# EAGLE design twip-mb2 (EAGLE 9.3.0)
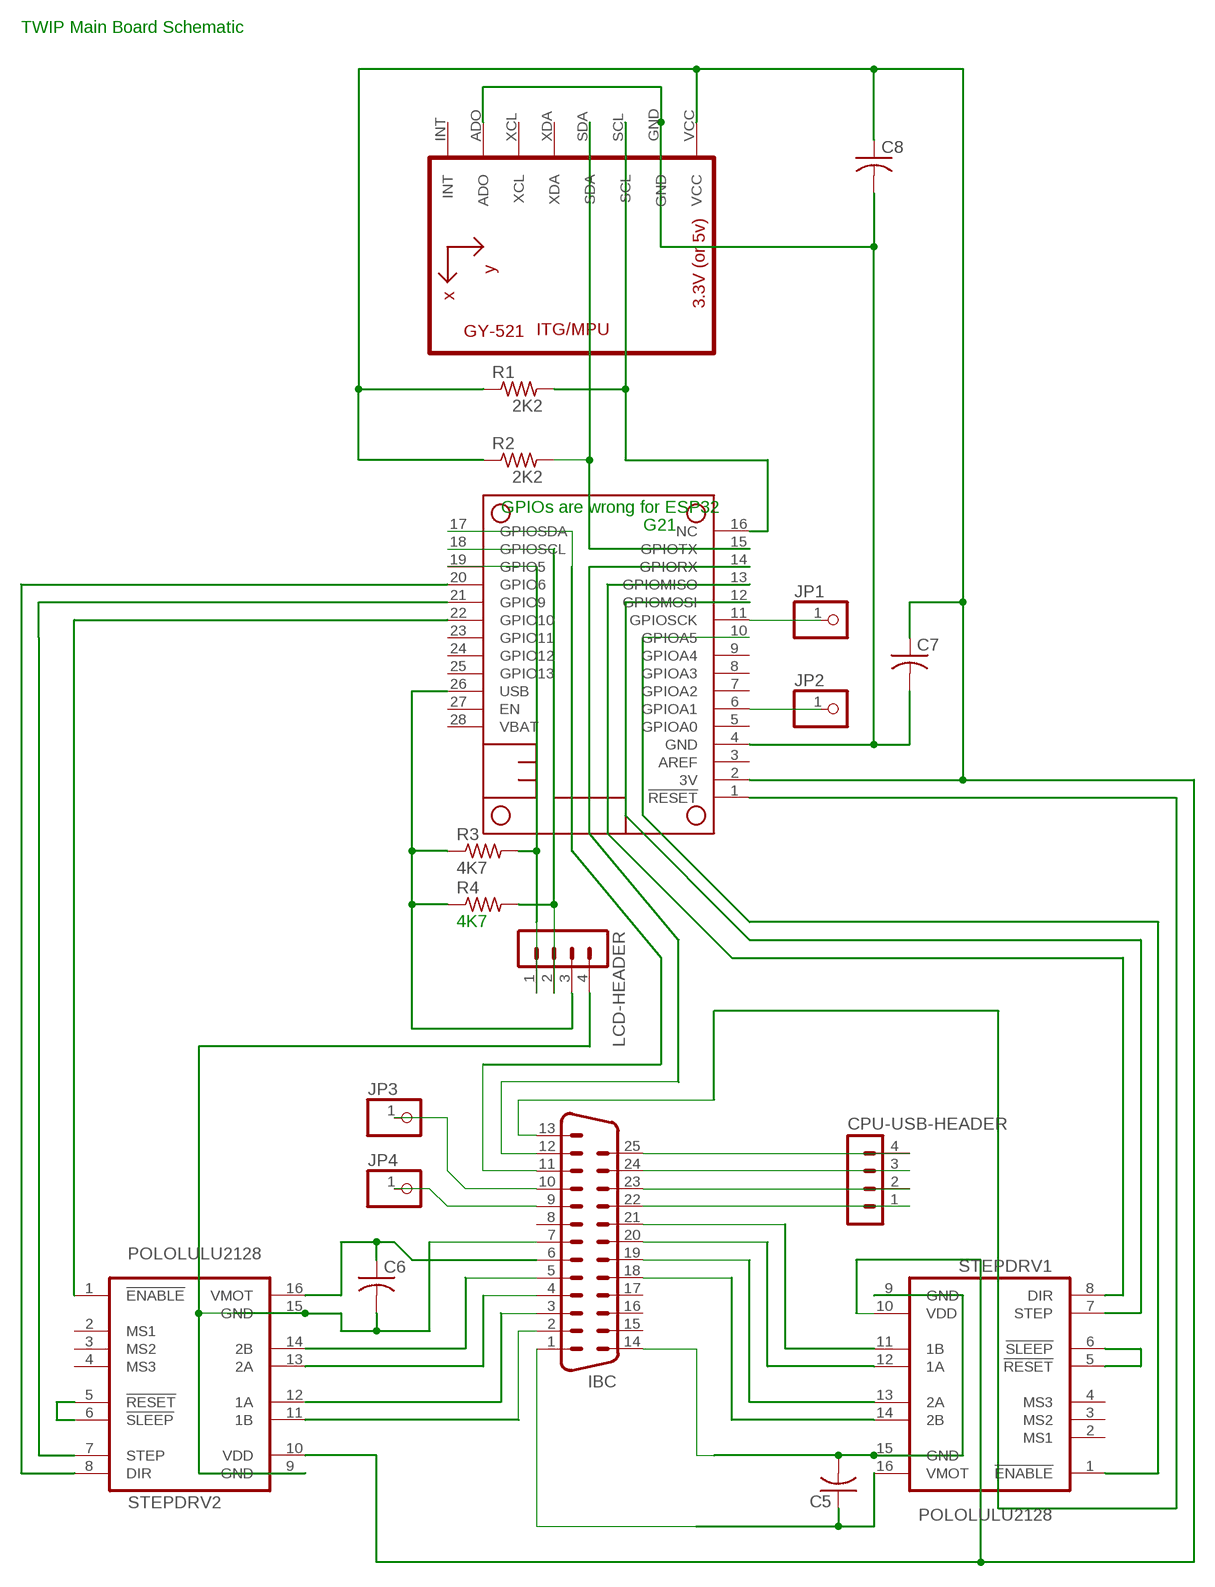
[diagram p0: schematic, sheet 1]

## Parts
C5  C-US050-024X044  [C050-024X044]
C6  C-US050-024X044  [C050-024X044]
C7  C-US050-024X044  [C050-024X044]
C8  C-US050-024X044  [C050-024X044]
CPU-USB-HEADER  MA04-1  [MA04-1]
IBC  M25VP  [M25VP]
JP1  PINHD-1X1  [1X01]
JP2  PINHD-1X1  [1X01]
JP3  PINHD-1X1  [1X01]
JP4  PINHD-1X1  [1X01]
LCD-HEADER  MA04-1  [MA04-1]
MS2  FEATHERWING_NOHOLES  [FEATHERWING_NOHOLES]
R1  2K2  R-US_0309/12  [0309/12]
R2  2K2  R-US_0309/12  [0309/12]
R3  4K7  R-US_0309/12  [0309/12]
R4  4K7  R-US_0309/12  [0309/12]
STEPDRV1  POLOLULU2128  [POLOLULU2128]
STEPDRV2  POLOLULU2128  [POLOLULU2128]
U1  GY-521MPU6050  [GY-521]

## Nets
3V: C7.1 C8.1 MS2.2(3V) R1.1 R2.1 STEPDRV1.10(VDD) STEPDRV2.10(VDD) U1.VCC
N$2: C7.2 C8.2 MS2.4(GND) U1.ADO U1.GND
N$3: IBC.18 STEPDRV1.14(2B)
N$4: IBC.19 STEPDRV1.13(2A)
N$5: MS2.12(GPIOMOSI) STEPDRV1.7(STEP)
N$6: IBC.20 STEPDRV1.12(1A)
N$7: IBC.21 STEPDRV1.11(1B)
N$8: IBC.2 STEPDRV2.11(1B)
N$9: IBC.3 STEPDRV2.12(1A)
N$10: IBC.4 STEPDRV2.13(2A)
N$11: LCD-HEADER.1 MS2.19(GPIO5) R3.2
N$12: IBC.5 STEPDRV2.14(2B)
N$13: CPU-USB-HEADER.4 IBC.25
N$14: CPU-USB-HEADER.3 IBC.24
N$15: MS2.13(GPIOMISO) STEPDRV1.8(DIR)
N$16: IBC.13 MS2.1(!RESET)
N$17: MS2.16(NC) R1.2 U1.SCL
N$18: CPU-USB-HEADER.2 IBC.23
N$19: IBC.12 MS2.14(GPIORX)
N$20: C5.2 IBC.14 STEPDRV1.9(GND) STEPDRV1.15(GND)
N$21: C6.1 IBC.6 STEPDRV2.16(VMOT)
N$22: C5.1 IBC.1 STEPDRV1.16(VMOT)
N$23: STEPDRV1.5(!RESET) STEPDRV1.6(!SLEEP)
N$24: STEPDRV2.5(!RESET) STEPDRV2.6(!SLEEP)
N$25: MS2.15(GPIOTX) R2.2 U1.SDA
N$27: MS2.20(GPIO6) STEPDRV2.8(DIR)
N$28: IBC.11 MS2.17(GPIOSDA)
N$29: MS2.21(GPIO9) STEPDRV2.7(STEP)
N$30: CPU-USB-HEADER.1 IBC.22
N$31: MS2.10(GPIOA5) STEPDRV1.1(!ENABLE)
N$32: JP1.1 MS2.11(GPIOSCK)
N$33: C6.2 IBC.7 LCD-HEADER.4 STEPDRV2.9(GND) STEPDRV2.15(GND)
N$34: MS2.22(GPIO10) STEPDRV2.1(!ENABLE)
N$35: LCD-HEADER.2 MS2.18(GPIOSCL) R4.2
N$36: JP2.1 MS2.6(GPIOA1)
N$37: IBC.10 JP3.1
N$38: IBC.9 JP4.1
USB: LCD-HEADER.3 MS2.26(USB) R3.1 R4.1
Unconnected: IBC.8 IBC.15 IBC.16 IBC.17 IBC.G1 IBC.G2 MS2.3(AREF) MS2.5(GPIOA0) MS2.7(GPIOA2) MS2.8(GPIOA3) MS2.9(GPIOA4) MS2.23(GPIO11) MS2.24(GPIO12) MS2.25(GPIO13) MS2.27(EN) MS2.28(VBAT) STEPDRV1.2(MS1) STEPDRV1.3(MS2) STEPDRV1.4(MS3) STEPDRV2.2(MS1) STEPDRV2.3(MS2) STEPDRV2.4(MS3) U1.INT U1.XCL U1.XDA

## Notes on the sheet
- TWIP Main Board Schematic
- GPIOs are wrong for ESP32
- G21

## Library data of the parts
C5-C8 = rcl:C-US: CAPACITOR, American symbol; SPICEPREFIX: C
CPU-USB-HEADER LCD-HEADER = con-lstb:MA04-1: PIN HEADER; OC_FARNELL: unknown; OC_NEWARK: unknown
IBC = con-subd:M25VP: SUB-D; OC_FARNELL: unknown; OC_NEWARK: unknown
JP1-JP4 = pinhead:PINHD-1X1: PIN HEADER
MS2 = microbuilder:FEATHERWING
R1-R4 = resistor:R-US_: RESISTOR, American symbol
STEPDRV1 STEPDRV2 = stepper_drivers_etc:POLOLULU2128
U1 = gy-521:GY-521

## Board
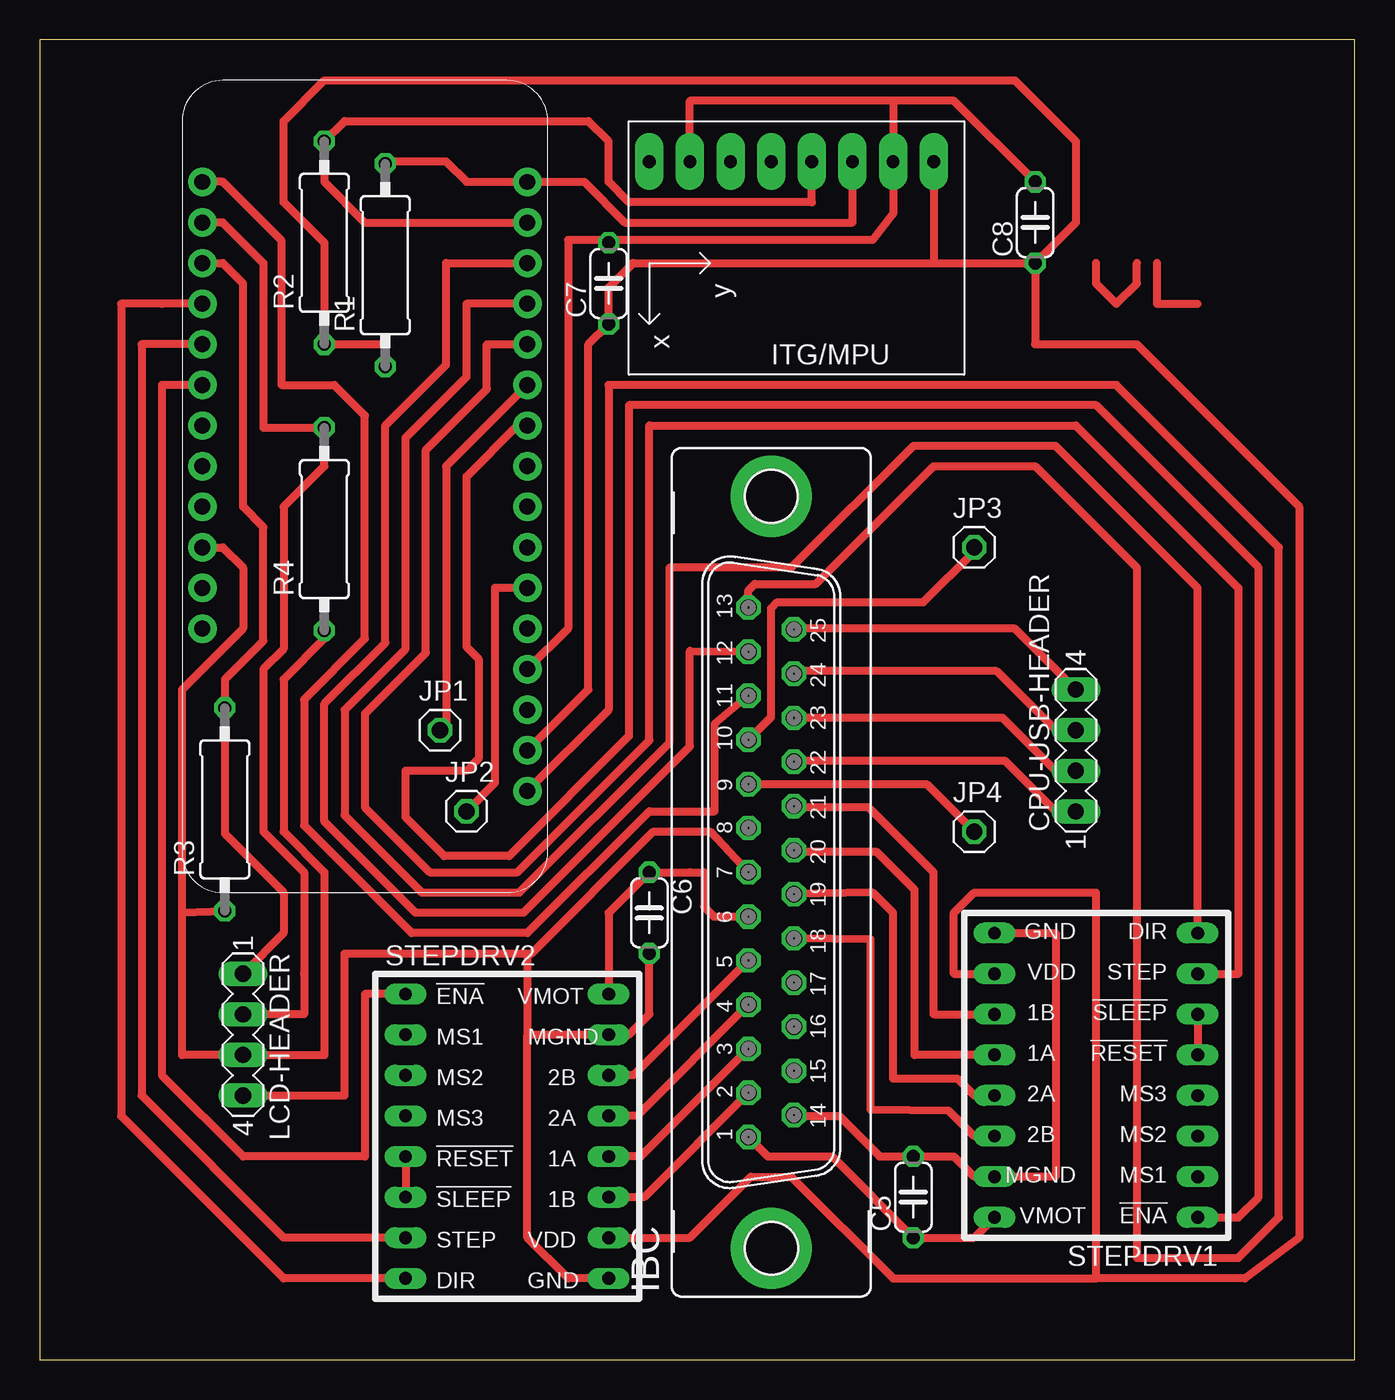
[diagram p1: board, top side]

Size 82.22 x 82.54 mm. Coordinates in mm from the lower left corner, seen from the top.
Outline: 0,0 82.22,0 82.22,82.54 0,82.54 0,0
Copper layers (1*16): Top 0.035mm / dielectric 1.5mm / Bottom 0.035mm
Design rules "default": minimum track width 6mil, minimum drill 0.35mm, track to track 6mil, track to pad 6mil, pad to pad 6mil, via to via 6mil, smd to smd 6mil, copper to edge 40mil, drill to drill 6mil, minimum pad ring 10mil, minimum via ring 8mil, stop-mask expansion 4mil, vias tented up to drill 0mil, thermal gap 10mil

### Footprints (pad centres in the part's own frame; a part is rotated, then mirrored left to right if it is on the bottom)
C050-024X044 = drill 0.813 octagon: 1 -2.54,0; 2 2.54,0
MA04-1 = drill 1.016 long: 1 -3.81,0; 2 -1.27,0; 3 1.27,0; 4 3.81,0
M25VP = drill 1.016 octagon: 1 -16.561,1.422; 2 -13.792,1.422; 3 -11.049,1.422; 4 -8.28,1.422; 5 -5.512,1.422; 6 -2.769,1.422; 7 0,1.422; 8 2.769,1.422; 9 5.512,1.422; 10 8.28,1.422; 11 11.049,1.422; 12 13.792,1.422; 13 16.561,1.422; 14 -15.189,-1.422; 15 -12.421,-1.422; 16 -9.652,-1.422; 17 -6.909,-1.422; 18 -4.14,-1.422; 19 -1.372,-1.422; 20 1.372,-1.422; 21 4.14,-1.422; 22 6.909,-1.422; 23 9.652,-1.422; 24 12.421,-1.422; 25 15.189,-1.422 | drill 3.302 pad 5.08: G1 -23.52,0; G2 23.52,0
1X01 = drill 1.016 octagon: 1 0,0
FEATHERWING_NOHOLES = drill 1 pad 1.778: 1 6.35,1.27; 2 8.89,1.27; 3 11.43,1.27; 4 13.97,1.27; 5 16.51,1.27; 6 19.05,1.27; 7 21.59,1.27; 8 24.13,1.27; 9 26.67,1.27; 10 29.21,1.27; 11 31.75,1.27; 12 34.29,1.27; 13 36.83,1.27; 14 39.37,1.27; 15 41.91,1.27; 16 44.45,1.27; 17 44.45,21.59; 18 41.91,21.59; 19 39.37,21.59; 20 36.83,21.59; 21 34.29,21.59; 22 31.75,21.59; 23 29.21,21.59; 24 26.67,21.59; 25 24.13,21.59; 26 21.59,21.59; 27 19.05,21.59; 28 16.51,21.59
0309/12 = drill 0.813 octagon: 1 -6.35,0; 2 6.35,0
POLOLULU2128 = drill 0.8 long: 1 -7.62,7.62; 2 -7.62,5.08; 3 -7.62,2.54; 4 -7.62,0; 5 -7.62,-2.54; 6 -7.62,-5.08; 7 -7.62,-7.62; 8 -7.62,-10.16; 9 5.08,-10.16; 10 5.08,-7.62; 11 5.08,-5.08; 12 5.08,-2.54; 13 5.08,0; 14 5.08,2.54; 15 5.08,5.08; 16 5.08,7.62
GY-521 = drill 0.8 pad 1.778 long: ADO -8.89,-6.35; GND -8.89,6.35; INT -8.89,-8.89; SCL -8.89,3.81; SDA -8.89,1.27; VCC -8.89,8.89; XCL -8.89,-3.81; XDA -8.89,-1.27

### Placement (x,y rotation side)
C5  54.61,10.16 90 top
C6  38.1,27.94 270 top
C7  35.56,67.31 90 top
C8  62.23,71.12 90 top
CPU-USB-HEADER  64.77,38.1 90 top
IBC  45.72,30.48 90 top
JP1  25.02,39.37 0 top
JP2  26.67,34.29 0 top
JP3  58.42,50.8 0 top
JP4  58.42,33.02 0 top
LCD-HEADER  12.7,20.32 270 top
MS2  31.75,29.21 90 top
R1  21.59,68.45 90 top
R2  17.78,69.85 90 top
R3  11.56,34.42 90 top
R4  17.78,51.94 90 top
STEPDRV1  64.77,16.51 180 top
STEPDRV2  30.48,15.24 0 top
U1  46.99,66.04 270 top

### Tracks (layer width: path | path; a pad name or v marks a point on that pad's centre or on a via)
3V
  Top 0.508: 66.04,5.08 75.35,5.08 78.74,7.62 78.74,53.34 68.58,63.5 62.23,63.5 C8.1 | 66.04,5.08 66.04,29.21 58.42,29.21 57.15,27.94 57.15,24.13 STEPDRV1.10 | 66.04,5.08 53.34,5.08 46.99,11.43 44.45,11.43 40.64,7.62 STEPDRV2.10 | 55.88,68.58 C8.1 | U1.VCC 55.88,68.58 | 55.88,68.58 37.08,68.58 35.56,67.06 C7.1 34.29,63.5 34.29,41.91 MS2.2 | C8.1 64.77,71.12 64.77,76.2 60.96,80.01 17.78,80.01 15.24,77.47 15.24,72.39 17.78,69.85 R2.1 21.59,63.5 R1.1
N$1
  Top 0.508: 68.58,68.58 68.58,67.31 67.31,66.04 66.04,67.31 66.04,68.58
N$2
  Top 0.508: 53.34,78.74 U1.GND 53.34,71.66 52.07,70.03 35.56,70.03 | MS2.4 33.02,45.72 33.02,70.03 35.56,70.03 | 53.34,78.74 40.64,78.74 U1.ADO | C8.2 57.15,78.74 53.34,78.74 | C7.2 35.56,70.03
N$3
  Top 0.508: STEPDRV1.14 58.42,13.97 56.82,15.57 51.94,15.62 51.94,26.29 IBC.18
N$4
  Top 0.508: STEPDRV1.13 58.42,16.51 57.35,17.58 53.34,17.58 53.34,27.94 52.07,29.21 IBC.19
N$5
  Top 0.508: STEPDRV1.7 74.93,24.13 74.93,48.26 64.77,58.42 38.1,58.42 38.1,38.73 29.84,30.48 24.38,30.48 20.32,34.54 20.32,40.39 24.13,44.2 24.13,56.9 27.94,60.71 27.94,63.5 MS2.12
N$6
  Top 0.508: STEPDRV1.12 54.69,19.05 54.69,29.39 52.32,31.75 47.24,31.75 IBC.20
N$7
  Top 0.508: STEPDRV1.11 55.88,21.59 55.88,30.48 51.82,34.54 47.22,34.54 IBC.21
N$8
  Top 0.508: IBC.2 37.77,10.16 STEPDRV2.11
N$9
  Top 0.508: IBC.3 37.57,12.7 STEPDRV2.12
N$10
  Top 0.508: IBC.4 37.34,15.24 STEPDRV2.13
N$11
  Top 0.508: MS2.19 11.43,68.58 12.7,67.31 12.7,53.34 13.97,52.07 13.97,44.96 11.56,42.55 R3.2 11.56,32.89 15.24,29.21 15.24,26.67 LCD-HEADER.1
N$12
  Top 0.508: STEPDRV2.14 36.83,17.78 37.11,17.78 IBC.5
N$13
  Top 0.152: 47.19,45.72 IBC.25
  Top 0.508: CPU-USB-HEADER.4 60.96,45.72 47.19,45.72
N$14
  Top 0.152: 47.3,43.05 IBC.24
  Top 0.508: CPU-USB-HEADER.3 63.5,39.37 59.82,43.05 47.3,43.05
N$15
  Top 0.508: MS2.13 26.67,66.04 26.67,61.47 22.86,57.66 22.86,44.45 19.05,40.64 19.05,34.04 23.88,29.21 29.97,29.21 39.37,38.61 39.37,49.53 46.99,49.53 54.61,57.15 63.5,57.15 72.39,48.26 STEPDRV1.8
N$16
  Top 0.508: MS2.1 35.56,40.64 35.56,60.96 67.31,60.96 77.47,50.8 77.47,8.89 74.93,6.35 68.58,6.35 68.58,49.53 62.23,55.88 55.88,55.88 48.51,48.51 44.7,48.51 44.3,48.11 IBC.13
N$17
  Top 0.152: 21.59,74.93 R1.2
  Top 0.508: U1.SCL 50.8,71.12 36.58,71.12 34.04,73.66 MS2.16 26.67,73.66 25.4,74.93 21.59,74.93
N$18
  Top 0.508: CPU-USB-HEADER.2 63.5,36.83 60.2,40.13 IBC.23
N$19
  Top 0.508: MS2.14 25.4,68.58 25.4,62.23 21.59,58.42 21.59,44.83 17.78,41.02 17.78,33.66 23.5,27.94 30.23,27.94 40.64,38.35 40.64,44.32 IBC.12
N$20
  Top 0.508: STEPDRV1.9 63.5,26.67 63.5,11.43 STEPDRV1.15 58.42,11.43 57.15,12.7 C5.2 52.5,12.7 49.96,15.24 47.19,15.24 IBC.14
N$21
  Top 0.508: STEPDRV2.16 35.56,27.94 C6.1 40.64,30.48 | 40.64,30.48 41.53,30.48 41.53,28.32 42.14,27.71 IBC.6 | 40.64,30.48
N$22
  Top 0.508: STEPDRV1.16 58.42,7.62 C5.1 49.53,12.7 45.52,12.7 IBC.1
N$23
  Top 0.508: STEPDRV1.6 STEPDRV1.5
N$24
  Top 0.508: STEPDRV2.5 STEPDRV2.6
N$25
  Top 0.508: MS2.15 20.32,71.12 17.78,73.66 R2.2 19.05,77.47 34.29,77.47 35.56,76.2 35.56,73.66 36.83,72.39 48.26,72.39 U1.SDA
N$26
  Top 0.508: 69.85,68.58 69.85,66.04 72.39,66.04
N$27
  Top 0.508: STEPDRV2.8 15.24,5.08 5.08,15.24 5.08,66.04 7.62,66.04 MS2.20
N$28
  Top 0.508: MS2.17 11.43,73.66 15.11,69.98 15.11,60.96 18.41,60.96 20.32,59.05 20.32,45.09 16.51,41.27 16.51,33.4 23.24,26.67 30.48,26.67 38.1,34.29 42.16,34.29 42.16,39.75 IBC.11
N$29
  Top 0.508: STEPDRV2.7 15.24,7.62 6.35,16.51 6.35,63.5 MS2.21
N$30
  Top 0.152: IBC.22 47.22,37.47
  Top 0.508: CPU-USB-HEADER.1 63.5,34.29 60.33,37.47 47.22,37.47
N$31
  Top 0.508: MS2.10 29.84,58.42 26.67,55.24 26.67,44.58 27.43,43.81 27.43,37.59 26.67,36.83 22.86,36.83 22.86,33.91 25.27,31.5 29.34,31.5 36.83,38.99 36.83,59.69 66.04,59.69 76.2,49.53 76.2,10.16 74.93,8.89 STEPDRV1.1
N$32
  Top 0.508: MS2.11 25.4,55.88 25.4,39.75 JP1.1
N$33
  Top 0.508: LCD-HEADER.4 19.05,16.51 19.05,25.4 30.48,25.4 | 30.48,25.4 30.48,20.32 | 30.48,20.32 30.48,7.62 33.02,5.08 STEPDRV2.9 | C6.2 38.1,21.59 36.83,20.32 STEPDRV2.15 30.48,20.32 | 30.48,25.4 30.73,25.4 38.35,33.02 41.91,33.02 IBC.7
N$34
  Top 0.508: STEPDRV2.1 20.32,22.86 20.32,12.7 12.7,12.7 7.62,17.78 7.62,60.96 MS2.22
N$35
  Top 0.508: MS2.18 11.43,71.12 13.97,68.58 13.97,58.29 R4.2 17.78,55.88 15.24,53.34 15.24,44.45 13.97,43.18 13.97,33.02 16.51,30.48 16.51,24.13 16.51,21.59 LCD-HEADER.2
N$36
  Top 0.508: MS2.6 28.45,48.26 28.45,36.07 JP2.1
N$37
  Top 0.508: IBC.10 45.72,40.18 45.72,46.99 46.1,47.37 55.24,47.37 58.42,50.55 JP3.1
N$38
  Top 0.508: IBC.9 55.45,35.99 JP4.1
USB
  Top 0.508: 8.89,27.98 8.89,19.05 LCD-HEADER.3 17.78,19.05 17.78,30.48 15.24,33.02 15.24,42.55 17.78,45.09 R4.1 | 8.89,27.98 8.89,41.91 12.7,45.72 12.7,49.53 11.43,50.8 MS2.26 | 8.89,27.98 R3.1